# EAGLE design SparkFun_LilyPad-Switched-Battery_StakingVias_LargePads (EAGLE 7.5.0)
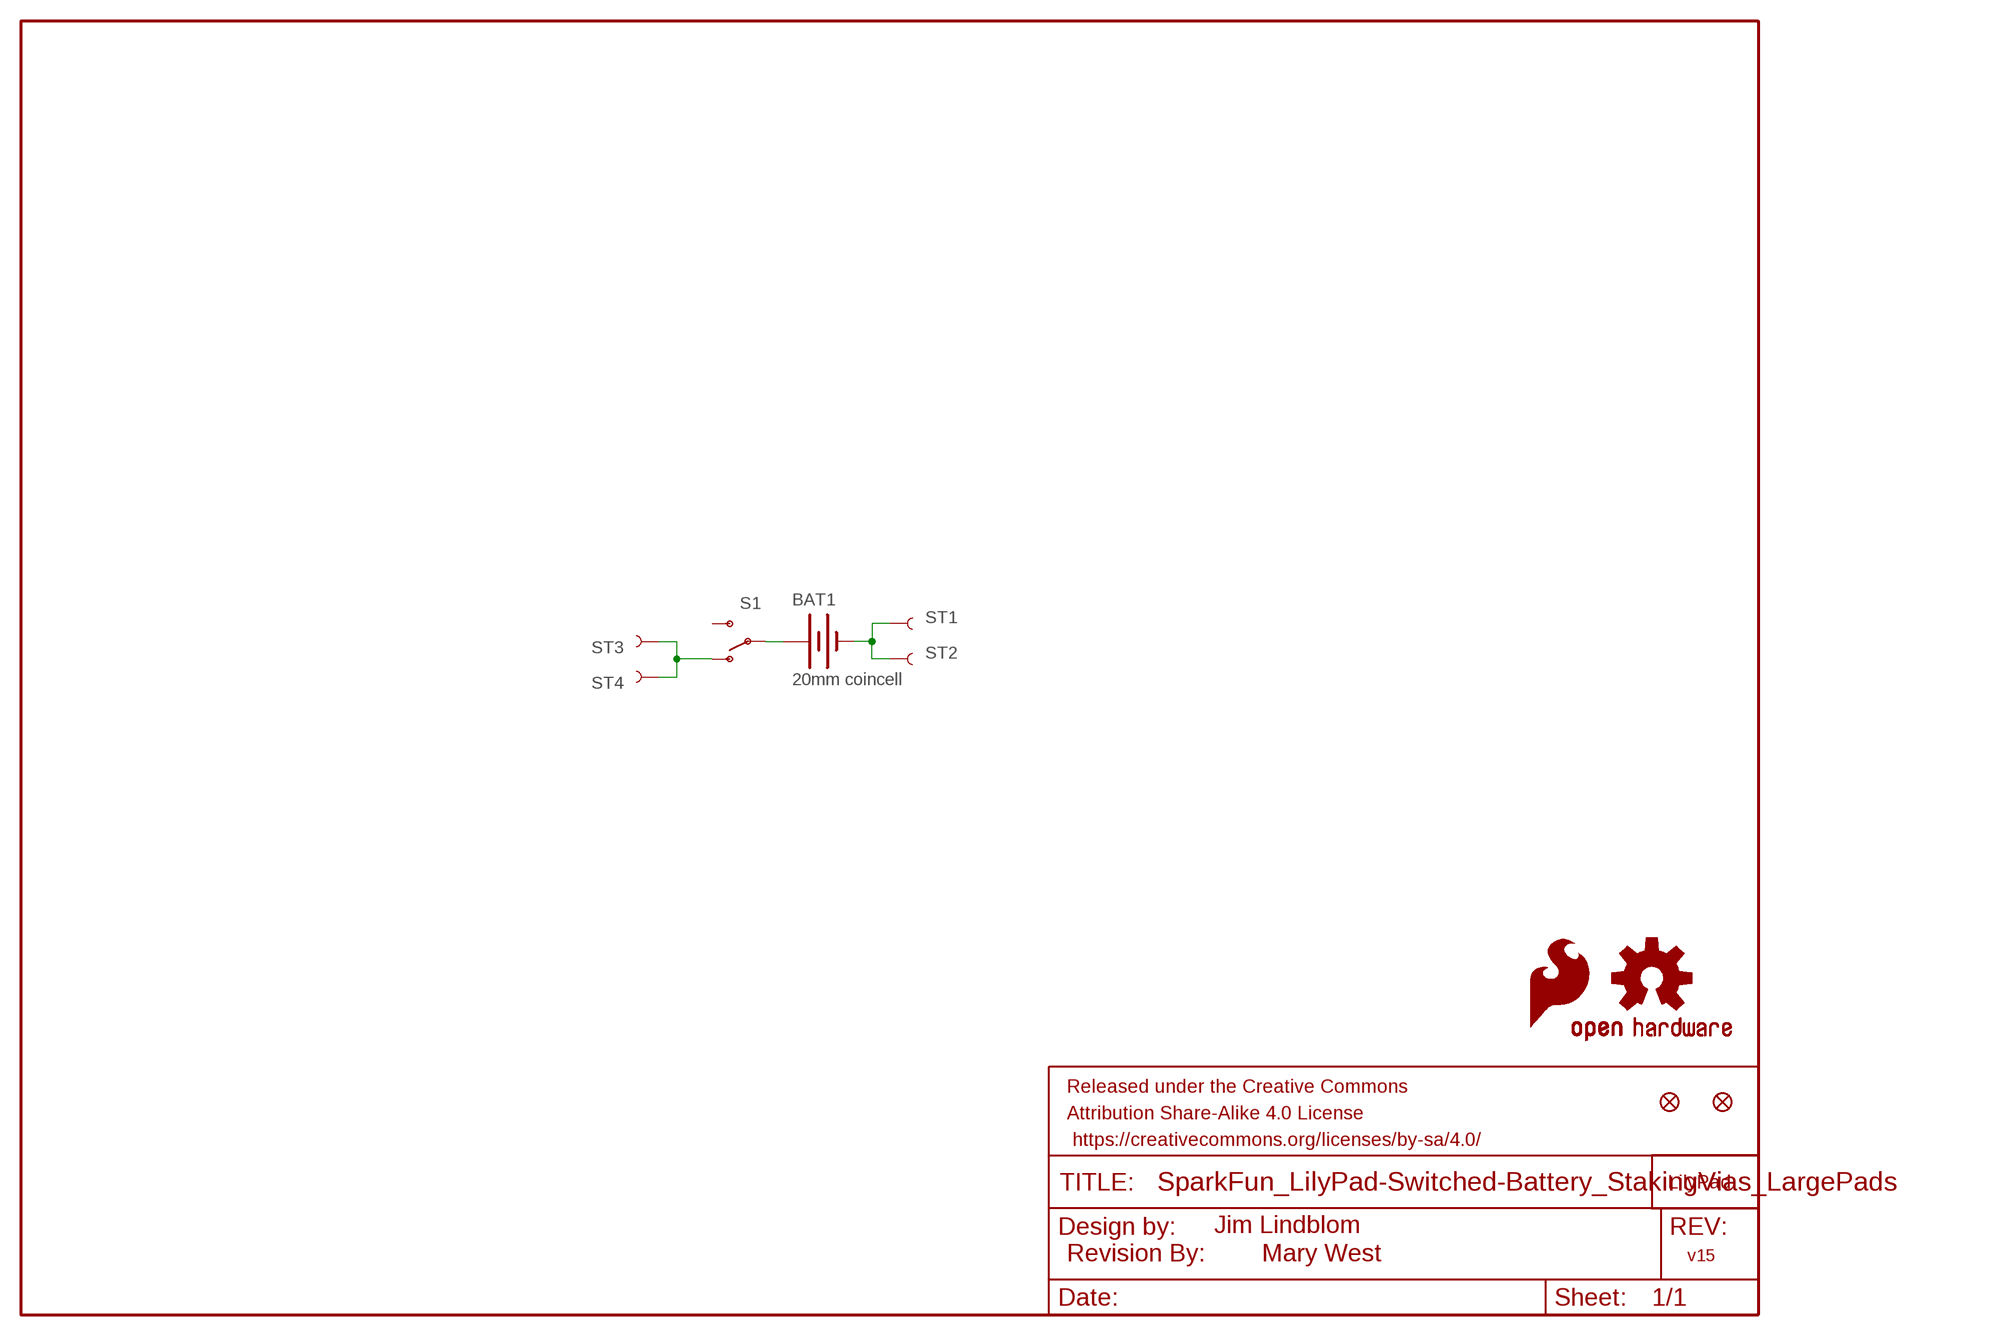
[diagram p0: schematic, sheet 1]

## Parts
BAT1  20mm coincell  BATTERY20MM_4LEGS  [BATTCON_20MM_4LEGS]
FRAME1  FRAME-LETTER  [CREATIVE_COMMONS]
JP1  FIDUCIALUFIDUCIAL  [MICRO-FIDUCIAL]
JP2  FIDUCIALUFIDUCIAL  [MICRO-FIDUCIAL]
LOGO1  SFE_LOGO_FLAME.1_INCH  [SFE_LOGO_FLAME_.1]
S1  SWITCH-SPDTSMD  [AYZ0202]
ST1  SEWTAP6  [PETAL-SMALL-2SIDE]
ST2  SEWTAP6  [PETAL-SMALL-2SIDE]
ST3  SEWTAP6  [PETAL-SMALL-2SIDE]
ST4  SEWTAP6  [PETAL-SMALL-2SIDE]
U$1  REVISION  [REVISION]
U$5  LOGO-LPLP  [LOGO-LILYPAD]
U$7  OSHW-LOGOS  [OSHW-LOGO-S]

## Nets
N$1: S1.1(O) ST3.1 ST4.1
N$2: BAT1.NEGATIVE(-) ST1.1 ST2.1
N$3: BAT1.POSITIVE@1(+) BAT1.POSITIVE@2(+) BAT1.POSITIVE@3(+) BAT1.POSITIVE@4(+) S1.2(P)
Unconnected: S1.3(S)

## Notes on the sheet
- Jim Lindblom
- Mary West | v15

## Library data of the parts
BAT1 = SparkFun-Electromechanical:BATTERY: Battery Holders Various common sizes : AA, AAA, 18650 (PRT-12895), 20mm coin cell and 12mm coin cell. 20MM_4LEGS, BATT-10373; PROD_ID: BATT-10373
FRAME1 = SparkFun-Aesthetics:FRAME-LETTER: Schematic Frame Standard 8.5x11 US Letter frame
JP1 JP2 = SparkFun-Aesthetics:FIDUCIAL: Fiducial Alignment Points Various fiducial points for machine vision alignment.
LOGO1 = SparkFun-Aesthetics:SFE_LOGO_FLAME: SFE Logo, flame only This is the SparkFun flame logo. The logo on the schematic will always be the same size; the package variant is the height of the flame. Default layer for the logo on the board is tSilk.
S1 = SparkFun-Electromechanical:SWITCH-SPDT: SPDT Switch Simple slide switch, Spark Fun Electronics SKU : COM-00102 DPDT SMT slide switch, AYZ0202, SWCH-08179; PROD_ID: SWCH-08179; SF_ID: COM-00597
ST1-ST4 = LilyPad-Wearables:SEWTAP: Sew Taps for LilyPad Boards.
U$1 = SparkFun-Aesthetics:REVISION
U$5 = LilyPad-Wearables:LOGO-LP
U$7 = SparkFun-Aesthetics:OSHW-LOGO: Open Source Hardware Logo This logo indicates the piece of hardware it is found on incorporates a OSHW license and/or adheres to the definition of open source hardware found here: http://freedomdefined.org/OSHW

## Board
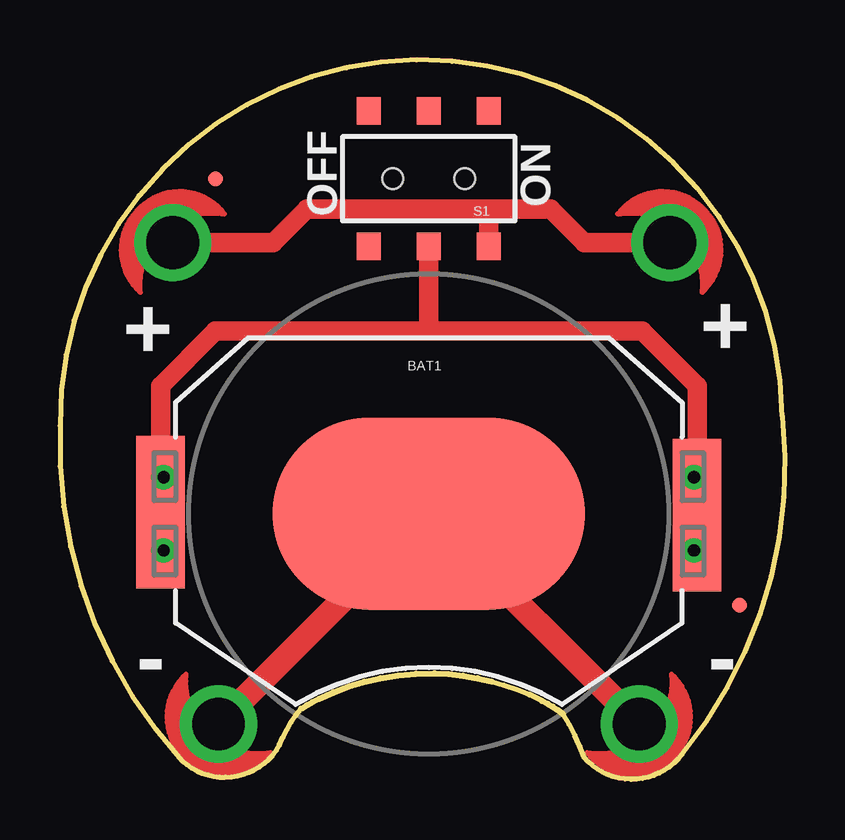
[diagram p1: board, top side]
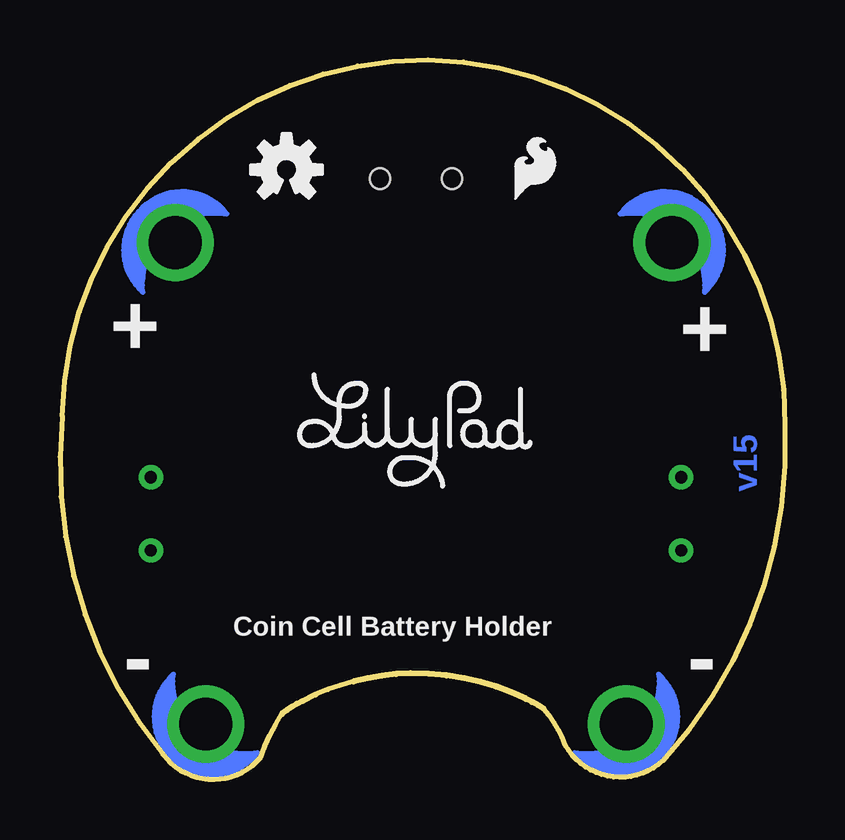
[diagram p2: board, bottom side, seen from below]

Size 30.2 x 29.99 mm. Coordinates in mm from the lower left corner, seen from the top.
Outline: 0,14.75 arc45 5.08,0.78 arc103 9.14,1.42 arc-20 10.05,2.94 arc-11 10.78,3.35 arc-17 13.35,4.21 arc-11 15.6,4.43 arc-13 17.97,4.08 arc-9 19.56,3.54 20.09,3.27 arc-14 20.96,2.72 arc-13 21.84,0.91 arc102 25.91,1.04 arc45 30.1,15.13 arc180 0,14.75
Copper layers (1*16): Top 0.035mm / dielectric 1.5mm / Bottom 0.035mm
Design rules "SparkFun-2-layer-STANDARD": minimum track width 10mil, minimum drill 20mil, track to track 10mil, track to pad 8mil, pad to pad 8mil, via to via 10mil, smd to smd 8mil, copper to edge 8mil, drill to drill 8mil, minimum pad ring 10mil, minimum via ring 10mil, stop-mask expansion 4mil, vias tented up to drill 25mil, thermal gap 10mil

### Footprints (pad centres in the part's own frame; a part is rotated, then mirrored left to right if it is on the bottom)
BATTCON_20MM_4LEGS = smd 13 x 8: NEGATIVE 0,0 | smd 2.032 x 3.175: POSITIVE@1 -11.176,1.651; POSITIVE@2 -11.176,-1.524; POSITIVE@3 11.176,1.524; POSITIVE@4 11.176,-1.651
MICRO-FIDUCIAL = smd 0.635 x 0.635: 1 0,0
AYZ0202 = smd 1 x 1.15: 1 -2.5,2.825; 2 0,2.825; 3 2.5,2.825; 4 -2.5,-2.825; 5 0,-2.825; 6 2.5,-2.825 | hole 0.85: 1.5,0; -1.5,0
PETAL-SMALL-2SIDE = drill 2.2: 1 0,0

### Placement (x,y rotation side)
BAT1  15.37,11.07 0 top
FRAME1  -21.68,-10.52 0 top  (outside the outline)
JP1  6.48,25.04 270 top
JP2  28.32,7.26 270 top
LOGO1  11.56,23.83 0 bottom
S1  15.37,25.04 180 top
ST1  6.6,2.31 317 top
ST2  24.13,2.31 43 top
ST3  4.7,22.37 223 top
ST4  25.4,22.37 137 top
U$1  -10.03,-13.06 0 top  (outside the outline)
U$5  15.37,14.88 0 bottom
U$7  20.76,25.42 0 bottom

### Tracks (layer width: path | path; a pad name or v marks a point on that pad's centre or on a via)
N$1
  Top 0.813: ST3.1 8.89,22.37 10.29,23.77 17.91,23.77 | ST4.1 21.84,22.37 20.45,23.77 17.91,23.77 | 17.91,23.77 17.87,23.73 S1.1
N$2
  Top 1.016: ST1.1 BAT1.NEGATIVE 15.62,11.07 15.62,10.81 ST2.1
N$3
  Top 0.813: S1.2 15.37,18.69 | 15.37,18.69 24.26,18.69 26.54,16.4 BAT1.POSITIVE@3 | BAT1.POSITIVE@1 4.19,16.4 6.48,18.69 15.37,18.69
  Top 1.016: BAT1.POSITIVE@3 BAT1.POSITIVE@4 | BAT1.POSITIVE@2 BAT1.POSITIVE@1
N$4  (via drill 0.51)
  other vias: 4.32,12.59
N$5  (via drill 0.51)
  other vias: 4.32,9.54
N$6  (via drill 0.51)
  other vias: 26.42,12.59
N$7  (via drill 0.51)
  other vias: 26.42,9.54

### Text on the board
Bottom: v15
tPlace: OFF | ON | + | + | - | -
bPlace: + | + | - | Coin Cell Battery Holder | -
Measures: All units in Inches
tDocu: NOTE: Use 0.032" board thickness | Jim Lindblom | Mary West | v15